# EAGLE design lis2dh12_breakout (EAGLE 8.3.2)
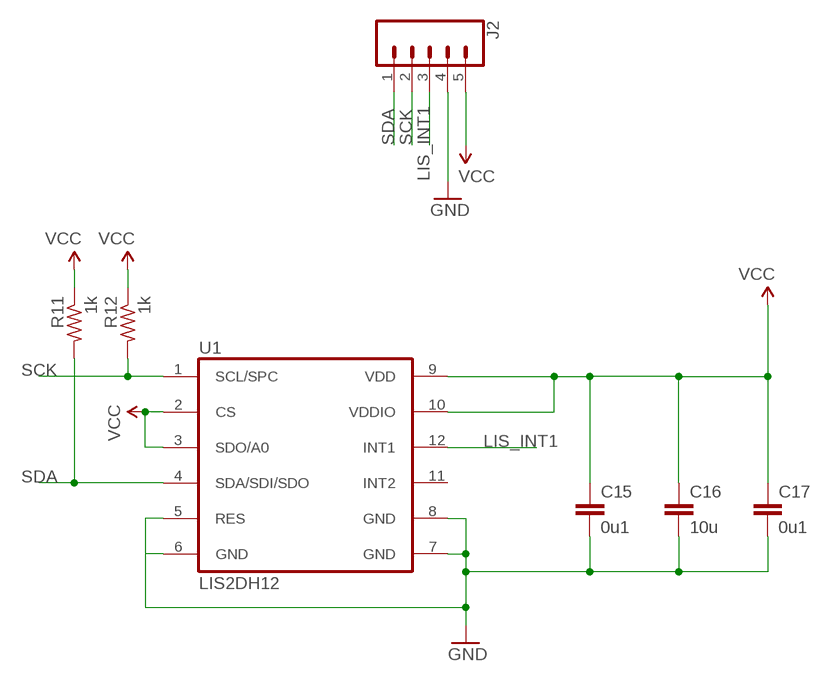
[diagram p0: schematic, sheet 1]

## Parts
C15  0u1  C-EUC0603  [C0603]
C16  10u  C-EUC0603  [C0603]
C17  0u1  C-EUC0603  [C0603]
J2  CONN_05NO_SILK  [1X05_NO_SILK]
R11  1k  R-US_R0603  [R0603]
R12  1k  R-US_R0603  [R0603]
U1  LIS2DH12  [LGA12]

## Nets
GND: C15.2 C16.2 C17.2 J2.4 U1.5(RES) U1.6(GND) U1.7(GND) U1.8(GND)
LIS_INT1: J2.3 U1.12(INT1)
SCK: J2.2 R12.2 U1.1(SCL/SPC)
SDA: J2.1 R11.2 U1.4(SDA/SDI/SDO)
VCC: C15.1 C16.1 C17.1 J2.5 R11.1 R12.1 U1.2(CS) U1.3(SDO/A0) U1.9(VDD) U1.10(VDDIO)
Unconnected: U1.11(INT2)

## Library data of the parts
C15-C17 = rcl:C-EU: CAPACITOR, European symbol
J2 = SparkFun-Connectors:CONN_05: Multi connection point. Often used as Generic Header-pin footprint for 0.1 inch spaced/style header connections On any of the 0.1 inch spaced packages, you can populate with these: Break Away Headers - Straight <https://www.sparkfun.com/products/116> (PRT-00116) Break Away Male Headers - Right Angle <https://www.sparkfun.com/products/553> (PRT-00553) Female Headers <https://www.sparkfun.com/products/115> (PRT-00115) Break Away Headers - Machine Pin <https://www.sparkfun.com/products/117> (PRT-00117) Break Away Female Headers - Swiss Machine Pin <https://www.sparkfun.com/products/743> (PRT-00743) For SCREWTERMINALS and SPRING TERMINALS visit here: Screw Terimnals on SparkFun.com <https://www.sparkfun.com/search/results?term=Screw+Terminals> (5mm/3.5mm/2.54mm spacing) This device is also useful as a general connection point to wire up your design to another part of your project. Our various solder wires solder well into these plated through hole pads. Hook-Up Wire - Assortment (Stranded, 22 AWG) <https://www.sparkfun.com/products/11375> (PRT-11375) Hook-Up Wire - Assortment (Solid Core, 22 AWG) <https://www.sparkfun.com/products/11367> (PRT-11367) View the entire wire category on our website here <https://www.sparkfun.com/categories/141> Special notes: Molex polarized connector foot print use with SKU : PRT-08231 with associated crimp pins and housings. 1MM SMD Version SKU: PRT-10208
R11 R12 = rcl:R-US_: RESISTOR, American symbol
U1 = Badge:LIS2DH12: MEMS Digital Output Motion Sensor

## Board
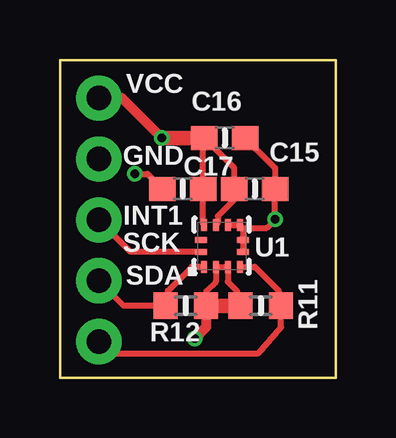
[diagram p1: board, top side]
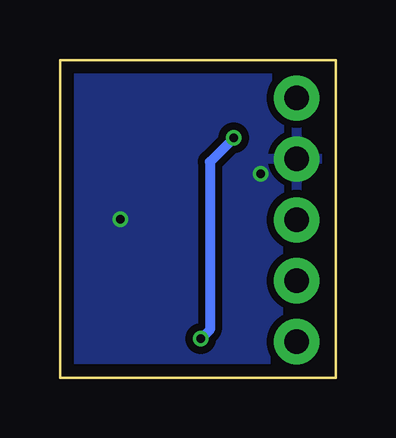
[diagram p2: board, bottom side, seen from below]

Size 11.5 x 13.25 mm. Coordinates in mm from the lower left corner, seen from the top.
Outline: 0,0 11.5,0 11.5,13.25 0,13.25 0,0
Copper layers (1*16): Top 0.035mm / dielectric 1.5mm / Bottom 0.035mm
Design rules "PCBNG_DRC_by_oren": minimum track width 6mil, minimum drill 12mil, track to track 6mil, track to pad 6mil, pad to pad 6mil, via to via 6mil, smd to smd 0mil, copper to edge 20mil, drill to drill 20mil, minimum pad ring 10mil, minimum via ring 6mil, stop-mask expansion 2mil, vias tented up to drill 100mil, thermal gap 10mil

### Footprints (pad centres in the part's own frame; a part is rotated, then mirrored left to right if it is on the bottom)
C0603 = smd 1.1 x 1: 1 -0.85,0; 2 0.85,0
1X05_NO_SILK = drill 1.016 pad 1.88: 1 0,0; 2 2.54,0; 3 5.08,0; 4 7.62,0; 5 10.16,0
R0603 = smd 1 x 1.1: 1 -0.85,0; 2 0.85,0
LGA12 = smd 0.5 x 0.25: 1 -0.875,0.75; 2 -0.875,0.25; 3 -0.875,-0.25; 4 -0.875,-0.75; 7 0.875,-0.75; 8 0.875,-0.25; 9 0.875,0.25; 10 0.875,0.75 | smd 0.25 x 0.5: 5 -0.25,-0.875; 6 0.25,-0.875; 11 0.25,0.875; 12 -0.25,0.875

### Placement (x,y rotation side)
C15  8.12,7.88 0 top
C16  6.88,10 0 top
C17  5.12,7.88 180 top
J2  1.62,1.5 90 top
R11  8.38,3 0 top
R12  5.25,3 180 top
U1  6.75,5.5 90 top

### Tracks (layer width: path | path; a pad name or v marks a point on that pad's centre or on a via)
GND  (via drill 0.35)
  Top 0.254: U1.8 U1.7 7.62,6.25 | U1.5 U1.6 7.62,6.25 | C16.2 8.97,8.75 C15.2 v8.97,6.6 8.62,6.25 7.62,6.25 | C17.2 3.65,8.5 v3.12,8.5
  pour Bottom (isolate 0.3, rank 2): 11.5,0 11.5,13.25 0,13.12 0,0
LIS_INT1
  Top 0.254: J2.3 2.96,5.25 U1.12
SCK
  Top 0.254: U1.1 5.5,4.62 4.5,3.62 4.5,3.1 R12.2 2.67,3 J2.2
SDA
  Top 0.254: U1.4 8.12,4.62 9.12,3.62 9.12,3.02 R11.2 | R11.2 8.85,3 | R11.2 9.22,2.1 8.25,1 2.12,1 J2.1
VCC  (via drill 0.35)
  Top 0.254: R12.1 6.1,3.6 6.5,4 U1.2 U1.3 7,4 7.38,3.62 7.38,3.02 R11.1 | U1.10 5.97,6.4 C17.1 5.97,9.95 C16.1 7.28,8.75 C15.1 7.28,7.42 6.59,6.74 6.59,6.47 U1.9
  Top 0.406: R12.1 6.1,2.1 v5.62,1.62 | J2.5 2.59,11.66 v4.25,10
  Top 0.61: C16.1 v4.25,10 | R12.1 R11.1
  Bottom 0.406: v4.25,10 5.25,9 5.25,2 v5.62,1.62

### Text on the board
tPlace: VCC | GND | INT1 | SCK | SDA